# EAGLE schematic gat8 rev 1 (EAGLE 6.1)

## Sheet 1 of 3
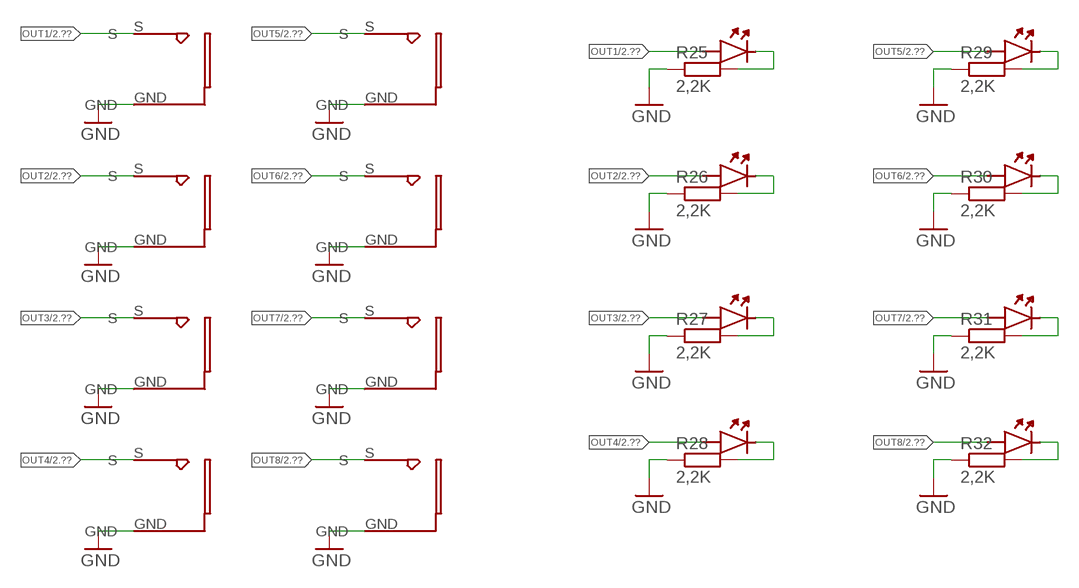
[diagram p0: schematic, sheet 1]

### Parts
LED8  LED  [LED]
OUT1  PJ302M  [PJ302M]
OUT2  PJ302M  [PJ302M]
OUT3  PJ302M  [PJ302M]
OUT4  PJ302M  [PJ302M]
OUT5  PJ302M  [PJ302M]
OUT6  PJ302M  [PJ302M]
OUT7  PJ302M  [PJ302M]
OUT8  PJ302M  [PJ302M]
R25  2,2K  R-EU_R1206  [R1206]
R26  2,2K  R-EU_R1206  [R1206]
R27  2,2K  R-EU_R1206  [R1206]
R28  2,2K  R-EU_R1206  [R1206]
R29  2,2K  R-EU_R1206  [R1206]
R30  2,2K  R-EU_R1206  [R1206]
R31  2,2K  R-EU_R1206  [R1206]
R32  2,2K  R-EU_R1206  [R1206]
U$1  LED  [LED]
U$2  LED  [LED]
U$3  LED  [LED]
U$4  LED  [LED]
U$5  LED  [LED]
U$6  LED  [LED]
U$7  LED  [LED]

### Nets
GND: OUT1.GND OUT2.GND OUT3.GND OUT4.GND OUT5.GND OUT6.GND OUT7.GND OUT8.GND R25.1 R26.1 R27.1 R28.1 R29.1 R30.1 R31.1 R32.1 ; also sheet 2,3
N$2: R26.2 U$2.GND
N$12: R25.2 U$1.GND
N$13: R27.2 U$3.GND
N$14: R28.2 U$4.GND
N$15: LED8.GND R32.2
N$16: R31.2 U$7.GND
N$17: R30.2 U$6.GND
N$18: R29.2 U$5.GND
OUT1: OUT1.S U$1.S ; also sheet 2
OUT2: OUT2.S U$2.S ; also sheet 2
OUT3: OUT3.S U$3.S ; also sheet 2
OUT4: OUT4.S U$4.S ; also sheet 2
OUT5: OUT5.S U$5.S ; also sheet 2
OUT6: OUT6.S U$6.S ; also sheet 2
OUT7: OUT7.S U$7.S ; also sheet 2
OUT8: LED8.S OUT8.S ; also sheet 2

## Sheet 2 of 3
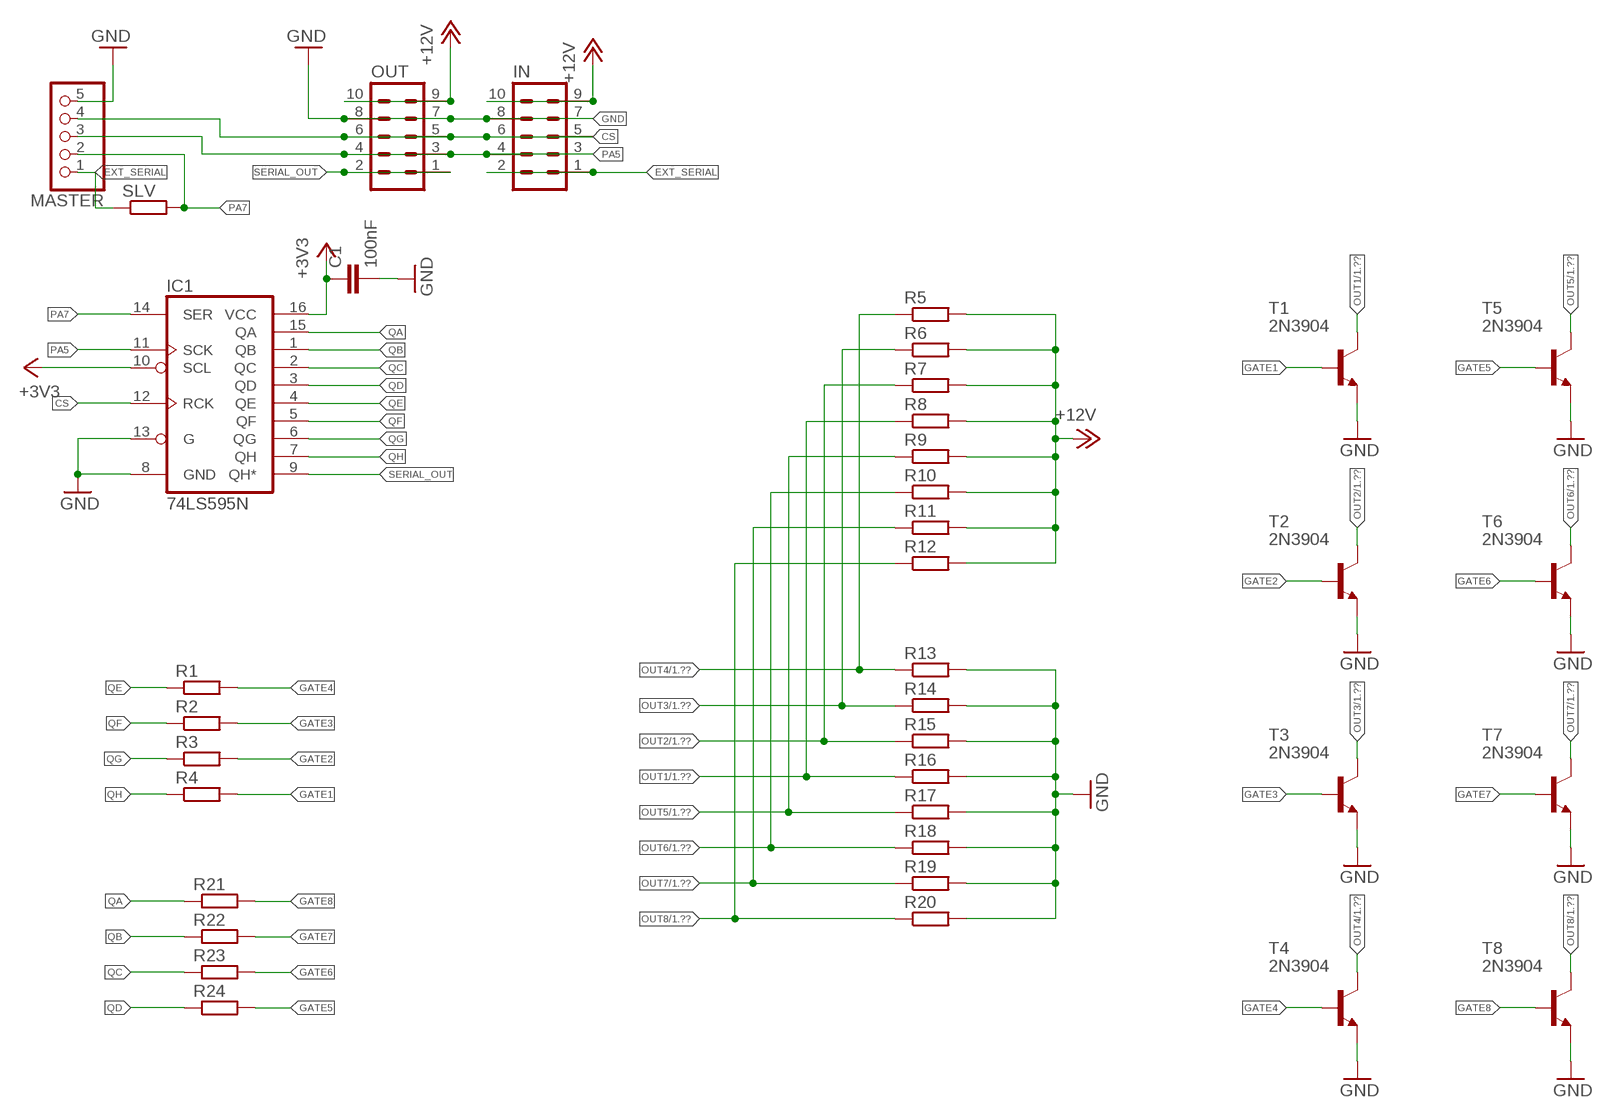
[diagram p1: schematic, sheet 2]

### Parts
C1  100nF  C-EUC1206K  [C1206K]
IC1  74LS595N  [DIL16]
IN  ML10  [ML10]
MASTER  PINHD-1X5_2.54  [1X05]
OUT  ML10  [ML10]
R1  R-EU_R1206  [R1206]
R2  R-EU_R1206  [R1206]
R3  R-EU_R1206  [R1206]
R4  R-EU_R1206  [R1206]
R5  R-EU_R1206  [R1206]
R6  R-EU_R1206  [R1206]
R7  R-EU_R1206  [R1206]
R8  R-EU_R1206  [R1206]
R9  R-EU_R1206  [R1206]
R10  R-EU_R1206  [R1206]
R11  R-EU_R1206  [R1206]
R12  R-EU_R1206  [R1206]
R13  R-EU_R1206  [R1206]
R14  R-EU_R1206  [R1206]
R15  R-EU_R1206  [R1206]
R16  R-EU_R1206  [R1206]
R17  R-EU_R1206  [R1206]
R18  R-EU_R1206  [R1206]
R19  R-EU_R1206  [R1206]
R20  R-EU_R1206  [R1206]
R21  R-EU_R1206  [R1206]
R22  R-EU_R1206  [R1206]
R23  R-EU_R1206  [R1206]
R24  R-EU_R1206  [R1206]
SLV  R-EU_R0805  [R0805]
T1  2N3904  [TO92]
T2  2N3904  [TO92]
T3  2N3904  [TO92]
T4  2N3904  [TO92]
T5  2N3904  [TO92]
T6  2N3904  [TO92]
T7  2N3904  [TO92]
T8  2N3904  [TO92]

### Nets
+3V3: C1.1 IC1.10(SCL) IC1.16(VCC) ; also sheet 3
+12V: IN.9 IN.10 OUT.9 OUT.10 R5.2 R6.2 R7.2 R8.2 R9.2 R10.2 R11.2 R12.2 ; also sheet 3
CS: IC1.12(RCK) IN.5 IN.6 MASTER.4 OUT.5 OUT.6
EXT_SERIAL: IN.1 IN.2 MASTER.1 SLV.1
GATE1: R4.2 T1.2(B)
GATE2: R3.2 T2.2(B)
GATE3: R2.2 T3.2(B)
GATE4: R1.2 T4.2(B)
GATE5: R24.2 T5.2(B)
GATE6: R23.2 T6.2(B)
GATE7: R22.2 T7.2(B)
GATE8: R21.2 T8.2(B)
GND: C1.2 IC1.8(GND) IC1.13(G) IN.7 IN.8 MASTER.5 OUT.7 OUT.8 R13.2 R14.2 R15.2 R16.2 R17.2 R18.2 R19.2 R20.2 T1.3(E) T2.3(E) T3.3(E) T4.3(E) T5.3(E) T6.3(E) T7.3(E) T8.3(E) ; also sheet 1,3
OUT1: R8.1 R16.1 T1.1(C) ; also sheet 1
OUT2: R7.1 R15.1 T2.1(C) ; also sheet 1
OUT3: R6.1 R14.1 T3.1(C) ; also sheet 1
OUT4: R5.1 R13.1 T4.1(C) ; also sheet 1
OUT5: R9.1 R17.1 T5.1(C) ; also sheet 1
OUT6: R10.1 R18.1 T6.1(C) ; also sheet 1
OUT7: R11.1 R19.1 T7.1(C) ; also sheet 1
OUT8: R12.1 R20.1 T8.1(C) ; also sheet 1
PA5: IC1.11(SCK) IN.3 IN.4 MASTER.3 OUT.3 OUT.4
PA7: IC1.14(SER) MASTER.2 SLV.2
QA: IC1.15(QA) R21.1
QB: IC1.1(QB) R22.1
QC: IC1.2(QC) R23.1
QD: IC1.3(QD) R24.1
QE: IC1.4(QE) R1.1
QF: IC1.5(QF) R2.1
QG: IC1.6(QG) R3.1
QH: IC1.7(QH) R4.1
SERIAL_OUT: IC1.9(QH*) OUT.1 OUT.2

## Sheet 3 of 3
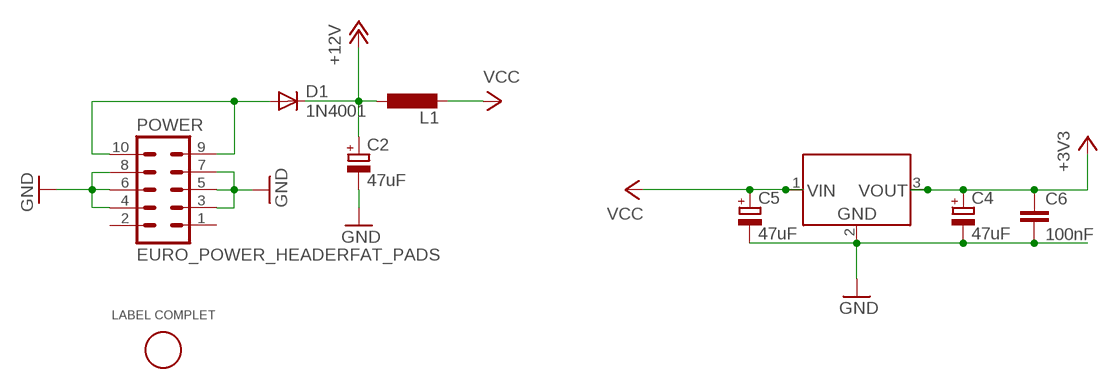
[diagram p2: schematic, sheet 3]

### Parts
C2  47uF  CPOL-EUE2-5  [E2-5]
C4  47uF  CPOL-EUE2-5  [E2-5]
C5  47uF  CPOL-EUE2-5  [E2-5]
C6  100nF  C-EUC1206K  [C1206K]
D1  1N4001  1N4004  [DO41-10]
IC2  LM117-3.3V  LM117-SOT223  [SOT223]
L1  L-EU0207/10  [0207/10]
POWER  EURO_POWER_HEADERFAT_PADS  [EURO_PWR_HEADER_FAT]
U$9  LABEL_COMPLETE  [LABELCOMPLETE]

### Nets
+3V3: C4.+ C6.1 IC2.3(VOUT) ; also sheet 2
+12V: C2.+ D1.C L1.1 ; also sheet 2
GND: C2.- C4.- C5.- C6.2 IC2.2(GND) POWER.3 POWER.4 POWER.5 POWER.6 POWER.7 POWER.8 ; also sheet 1,2
N$1: D1.A POWER.9 POWER.10
VCC: C5.+ IC2.1(VIN) L1.2
Unconnected: POWER.1 POWER.2

## Library data of the parts
C1 C6 = resistor-mod:C-EU: CAPACITOR, European symbol
C2 C4 C5 = resistor-mod:CPOL-EU: POLARIZED CAPACITOR, European symbol
D1 = diode:1N4004: DIODE general purpose rectifier, 1 A
IC1 = SparkFun-DigitalIC:74*595: 8-bit SHIFT REGISTER, output latch
IC2 = v-reg mod:LM117-SOT223
IN OUT = con-ml:ML10: HARTING; OC_FARNELL: unknown; OC_NEWARK: unknown
L1 = resistor-mod:L-EU: INDUCTOR, European symbol
LED8 U$1-U$7 = LED:LED
MASTER = pinhead 2:PINHD-1X5: PIN HEADER
OUT1-OUT8 = PJ203M 3.5mm:PJ302M: Klinkenbuchse 3.5mm Thonk
POWER = MusicThingModular mod:EURO_POWER_HEADER: Power Header 10 pin power header for Eurorack Power Supplies Variants with fatter pads for easier soldering, and the LOCK variant which has 5mil offset pins to hold the component in place before soldering
R1-R32 SLV = resistor-mod:R-EU_: RESISTOR, European symbol
T1-T8 = transistor:2N3904: NPN TRANSISTOR
U$9 = labels links:LABEL_COMPLETE